# Altium schematic sheet VUMeterSchematicAltium.schdoc
size 161 x 133 mm
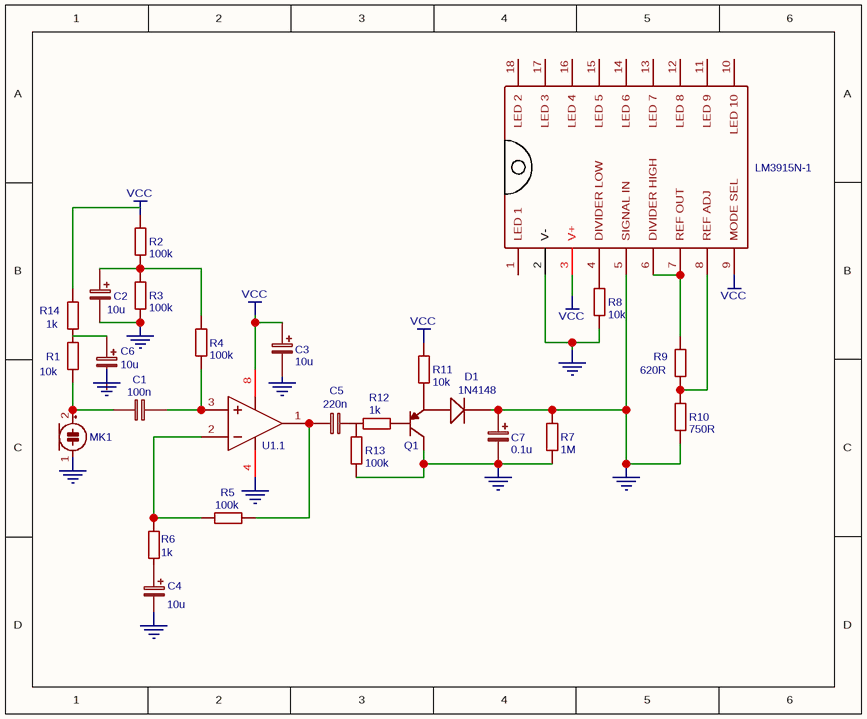
[diagram p0: VUMeterSchematicAltium.schdoc]

## Parts
C1  100n  [RAD-0.1]
C2  10u  [CAP-D3.0XF1.5]
C3  10u  [CAP-D3.0XF1.5]
C4  10u  [CAP-D3.0XF1.5]
C5  220n  [RAD-0.1]
C6  10u  [CAP-D3.0XF1.5]
C7  0.1u  [CAP-D3.0XF1.5]
D1  1N4148  [DO-35]
MK1  Microphone_Condenser  [NONE]  (value not drawn)
Q1  2N3906  [TO-92(TO-92-3)]  (value not drawn)
R1  10k  [AXIAL-0.3]
R2  100k  [AXIAL-0.3]
R3  100k  [AXIAL-0.3]
R4  100k  [AXIAL-0.3]
R5  100k  [AXIAL-0.3]
R6  1k  [AXIAL-0.3]
R7  1M  [AXIAL-0.3]
R8  10k  [AXIAL-0.3]
R9  620R  [AXIAL-0.3]
R10  750R  [AXIAL-0.3]
R11  10k  [AXIAL-0.3]
R12  1k  [AXIAL-0.3]
R13  100k  [AXIAL-0.3]
R14  1k  [AXIAL-0.3]
U1.1  NE5532AD  [SOIC8]  (value not drawn)
U2  LM3915N-1  [DIP18]

## Nets
GND: C2.2 C7.1 C7.2 D1.2(K) Q1.3(C) R3.1 R7.1 R7.2 R8.1 R10.1 R13.1 U1.1.4(VCC+) U2.2(V-) U2.5(SIGNAL_IN)
VCC: C3.1 R2.2 R11.2 U1.1.8(VCC-) U2.3(V+) U2.9(MODE_SEL)
NetC1_1: C1.1 MK1.2(+) R1.1
NetC1_2: C1.2 R4.1 U1.1.3(IN1+)
NetC2_1: C2.1 R2.1 R3.2 R4.2
NetC5_1: C5.1 R5.2 U1.1.1(OUT1)
NetQ1_1: Q1.1(E) R11.1
NetR5_1: R5.1 R6.2 U1.1.2(IN1-)
NetR8_2: R8.2 U2.4(DIVIDER_LOW)
NetR9_1: R9.1 R10.2 U2.8(REF_ADJ)
NetR9_2: R9.2 U2.6(DIVIDER_HIGH) U2.7(REF_OUT)

Not connected (* = marked no-connect by the designer): C3 2; C4 1 2; C5 2; C6 1 2; D1 1(A); MK1 1(-); Q1 2(B); R1 2; R6 1; R12 1 2; R13 2; R14 1 2; U2 1(LED_1) 10(LED_10) 11(LED_9) 12(LED_8) 13(LED_7) 14(LED_6) 15(LED_5) 16(LED_4) 17(LED_3) 18(LED_2)

## Notes on the sheet
- Labels drawn without touching a wire or pin: GND

## Library data of the parts
C1-C7 = (no symbol name): nameAlias: Value(F); BOM_Manufacturer Part: ?; spicePre: C; spiceSymbolName: Capacitor
D1 = (no symbol name): BOM_Manufacturer: ST; BOM_LCSC: C14516; BOM_Supplier: LCSC; BOM_Manufacturer Part: 1N4148; spicePre: D
MK1 = (no symbol name): Contributor: KiCAD; license: https://www.gnu.org/licenses/lgpl-2.1.html; BOM_Manufacturer Part: ?; spicePre: M
Q1 = (no symbol name): BOM_Manufacturer: CJ; BOM_LCSC: C9809; BOM_Supplier: LCSC; BOM_Manufacturer Part: 2N3906; spicePre: Q
R1-R14 = (no symbol name): nameAlias: Value(Ω); BOM_Manufacturer Part: ?; spicePre: R; spiceSymbolName: Resistor
U1.1 = (no symbol name): catid: 20; description: Dual Low-Noise Operational Amplifier, 10 to 30 V, 0 to 70 degC, 8-pin SOIC (D8), Green (RoHS  no SbBr); BOM_Manufacturer Part: ?; spicePre: U
U2 = (no symbol name): catid: 20; description: DotBar Display Driver, 18-pin MDIP; sourceId: XH6NrqqLf; timeStamp: 1459592158; BOM_Manufacturer Part: ?; spicePre: U